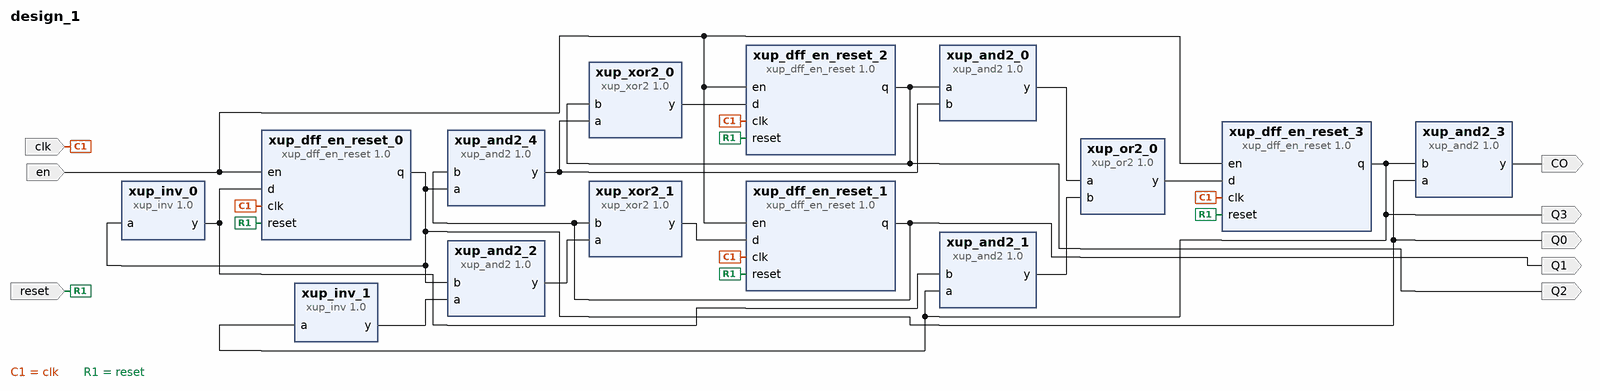
[diagram p0: block diagram of the top level]
# Vivado block design design_1, xc7a35tcpg236-1, Vivado 2023.1
create_bd_design design_1

create_bd_port -dir I clk
create_bd_port -dir I en
create_bd_port -dir I reset
create_bd_port -dir O CO
create_bd_port -dir O Q0
create_bd_port -dir O Q1
create_bd_port -dir O Q2
create_bd_port -dir O Q3

create_bd_cell -type ip -vlnv xilinx.com:XUP:xup_dff_en_reset:1.0 xup_dff_en_reset_0
create_bd_cell -type ip -vlnv xilinx.com:XUP:xup_inv:1.0 xup_inv_0
create_bd_cell -type ip -vlnv xilinx.com:XUP:xup_dff_en_reset:1.0 xup_dff_en_reset_1
create_bd_cell -type ip -vlnv xilinx.com:XUP:xup_dff_en_reset:1.0 xup_dff_en_reset_2
create_bd_cell -type ip -vlnv xilinx.com:XUP:xup_dff_en_reset:1.0 xup_dff_en_reset_3
create_bd_cell -type ip -vlnv xilinx.com:XUP:xup_and2:1.0 xup_and2_0
create_bd_cell -type ip -vlnv xilinx.com:XUP:xup_and2:1.0 xup_and2_1
create_bd_cell -type ip -vlnv xilinx.com:XUP:xup_or2:1.0 xup_or2_0
create_bd_cell -type ip -vlnv xilinx.com:XUP:xup_inv:1.0 xup_inv_1
create_bd_cell -type ip -vlnv xilinx.com:XUP:xup_and2:1.0 xup_and2_2
create_bd_cell -type ip -vlnv xilinx.com:XUP:xup_and2:1.0 xup_and2_3
create_bd_cell -type ip -vlnv xilinx.com:XUP:xup_xor2:1.0 xup_xor2_0
create_bd_cell -type ip -vlnv xilinx.com:XUP:xup_and2:1.0 xup_and2_4
create_bd_cell -type ip -vlnv xilinx.com:XUP:xup_xor2:1.0 xup_xor2_1

# ---- connections ----

connect_bd_net [get_bd_ports clk] \
  [get_bd_pins xup_dff_en_reset_0/clk] [get_bd_pins xup_dff_en_reset_1/clk] [get_bd_pins xup_dff_en_reset_2/clk] \
  [get_bd_pins xup_dff_en_reset_3/clk]
connect_bd_net [get_bd_ports en] \
  [get_bd_pins xup_dff_en_reset_0/en] [get_bd_pins xup_dff_en_reset_1/en] [get_bd_pins xup_dff_en_reset_2/en] \
  [get_bd_pins xup_dff_en_reset_3/en]
connect_bd_net [get_bd_ports reset] \
  [get_bd_pins xup_dff_en_reset_0/reset] [get_bd_pins xup_dff_en_reset_1/reset] [get_bd_pins xup_dff_en_reset_2/reset] \
  [get_bd_pins xup_dff_en_reset_3/reset]
connect_bd_net [get_bd_pins xup_and2_0/y] [get_bd_pins xup_or2_0/a]
connect_bd_net [get_bd_pins xup_and2_1/y] [get_bd_pins xup_or2_0/b]
connect_bd_net [get_bd_pins xup_and2_2/y] [get_bd_pins xup_xor2_1/a]
connect_bd_net [get_bd_pins xup_and2_3/y] [get_bd_ports CO]
connect_bd_net [get_bd_pins xup_and2_4/y] [get_bd_pins xup_xor2_0/a] [get_bd_pins xup_and2_0/b]
connect_bd_net [get_bd_pins xup_dff_en_reset_0/q] \
  [get_bd_pins xup_inv_0/a] [get_bd_pins xup_and2_3/a] [get_bd_pins xup_and2_4/a] [get_bd_pins xup_and2_2/b] [get_bd_ports Q0]
connect_bd_net [get_bd_pins xup_dff_en_reset_1/q] [get_bd_pins xup_and2_4/b] [get_bd_pins xup_xor2_1/b] [get_bd_ports Q1]
connect_bd_net [get_bd_pins xup_dff_en_reset_2/q] [get_bd_pins xup_and2_0/a] [get_bd_pins xup_xor2_0/b] [get_bd_ports Q2]
connect_bd_net [get_bd_pins xup_dff_en_reset_3/q] [get_bd_pins xup_and2_1/a] [get_bd_pins xup_inv_1/a] [get_bd_pins xup_and2_3/b] [get_bd_ports Q3]
connect_bd_net [get_bd_pins xup_inv_0/y] [get_bd_pins xup_and2_1/b] [get_bd_pins xup_dff_en_reset_0/d]
connect_bd_net [get_bd_pins xup_inv_1/y] [get_bd_pins xup_and2_2/a]
connect_bd_net [get_bd_pins xup_or2_0/y] [get_bd_pins xup_dff_en_reset_3/d]
connect_bd_net [get_bd_pins xup_xor2_0/y] [get_bd_pins xup_dff_en_reset_2/d]
connect_bd_net [get_bd_pins xup_xor2_1/y] [get_bd_pins xup_dff_en_reset_1/d]

validate_bd_design
save_bd_design
